# Altium project CAN_Termination.PrjPcb
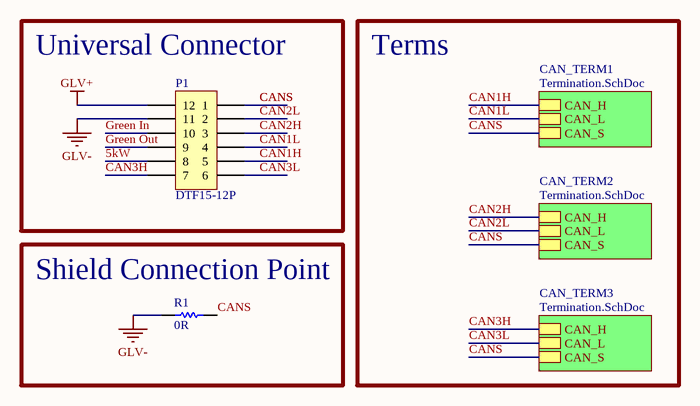
[diagram p0: Top_Level.SchDoc]
2 sheets, 14 parts. Net scope: hierarchical (ports join the sheet entries above them; power ports are global).
Board file: PCB.PcbDoc
Sheets:
  Top_Level.SchDoc
    CAN_TERM1 = Termination.SchDoc
    CAN_TERM2 = Termination.SchDoc
    CAN_TERM3 = Termination.SchDoc

## Sheet Top_Level.SchDoc
size A4; SheetNumber: 1; SheetTotal: 2

### Parts
P1  DTF15-12P  [DTF15-12P]
R1  0R  [0805]

### Blocks framed on the sheet
Universal Connector: P1
Shield Connection Point: R1

### Sub-sheets
CAN_TERM1 = Termination.SchDoc: CAN_H, CAN_L, CAN_S
CAN_TERM2 = Termination.SchDoc: CAN_H, CAN_L, CAN_S
CAN_TERM3 = Termination.SchDoc: CAN_H, CAN_L, CAN_S

### Nets
GLV+: P1.12
GLV-: P1.11 R1.1
5kW: P1.8
CAN1H: P1.5 ; sheet CAN_TERM1/CAN_H
CAN1L: P1.4 ; sheet CAN_TERM1/CAN_L
CAN2H: P1.3 ; sheet CAN_TERM2/CAN_H
CAN2L: P1.2 ; sheet CAN_TERM2/CAN_L
CAN3H: P1.7 ; sheet CAN_TERM3/CAN_H
CAN3L: P1.6 ; sheet CAN_TERM3/CAN_L
CANS: P1.1 R1.2 ; sheet CAN_TERM1/CAN_S, sheet CAN_TERM2/CAN_S, sheet CAN_TERM3/CAN_S
Green In: P1.10
Green Out: P1.9

### Notes on the sheet
- Terms

### Library data of the parts
P1 = DTF15-12P[[/\]]DTF15-12P: Positions: 12; Pitch: 4.44mm; Row Spacing: 9.12 mm; Angle: 0; Flange: No; Contact: Copper Alloy; Part Number: DTF15-12P; Digikey Part Number: 1734-1647-ND; Digikey Link: https://www.digikey.com.au/product-detail/en/te-connectivity-deutsch-connectors/DTF15-12PA/1734-1647-ND/7220164
R1 = RC0805FR070RL: DNP; Manufacturer: YAGEO; Tolerance: 0.01; Rated Voltage: 0.125W; Part Number: RC0805FR070RL; Value: 0R; Material: FR-07; Digikey Part Number: 311-0.0CRCT-ND

## Sheet Termination.SchDoc
size A4; SheetNumber: 2; SheetTotal: 2
Used 3 times, as channels CAN_TERM1, CAN_TERM2, CAN_TERM3. Parts and nets are listed once, with the designators drawn on the sheet.
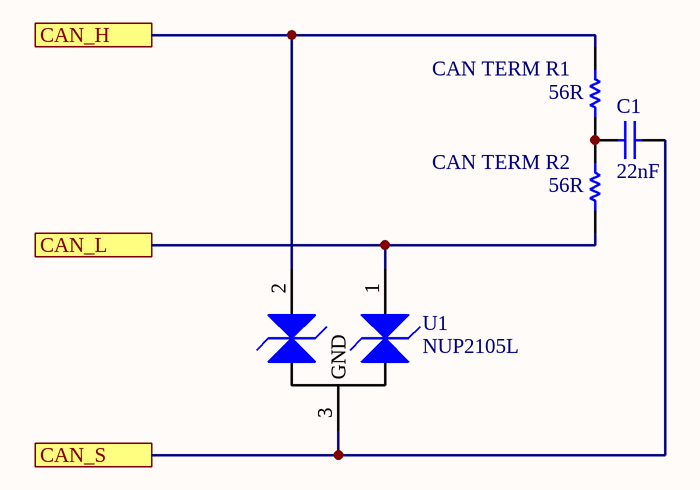
[diagram p1: Termination.SchDoc]

### Parts
C1  22nF  [0805]
CAN_TERM_R1  56R  [0805]
CAN_TERM_R2  56R  [0805]
U1  NUP2105L  [ON SOT-23]

### Ports
CAN_H, CAN_L, CAN_S

### Nets
CAN_H: CAN_TERM_R1.2 U1.2(CAN_L) ; port CAN_H
CAN_L: CAN_TERM_R2.1 U1.1(CAN_H) ; port CAN_L
CAN_S: C1.2 U1.3(GND) ; port CAN_S
NetC1_1: C1.1 CAN_TERM_R1.1 CAN_TERM_R2.2

### Channels
CAN_TERM1: designators C1=C?_CAN_TERM1 CAN TERM R1=CAN_TERM_R?_CAN_TERM1#1 CAN TERM R2=CAN_TERM_R?_CAN_TERM1#2 U1=U?_CAN_TERM1; ports CAN_H=CAN1H CAN_L=CAN1L CAN_S=CANS
CAN_TERM2: designators C1=C?_CAN_TERM2 CAN TERM R1=CAN_TERM_R?_CAN_TERM2#1 CAN TERM R2=CAN_TERM_R?_CAN_TERM2#2 U1=U?_CAN_TERM2; ports CAN_H=CAN2H CAN_L=CAN2L CAN_S=CANS
CAN_TERM3: designators C1=C?_CAN_TERM3 CAN TERM R1=CAN_TERM_R?_CAN_TERM3#1 CAN TERM R2=CAN_TERM_R?_CAN_TERM3#2 U1=U?_CAN_TERM3; ports CAN_H=CAN3H CAN_L=CAN3L CAN_S=CANS

### Library data of the parts
C1 = GCM21B5C1H223JA16L: Manufacturer: muRata; Tolerance: ±5%; Material: C0G, NP0; Rated Voltage: 50V; Part Number: GCM21B5C1H223JA16L; Value: 22nF; Digikey Part Number: 490-5318-1-ND
CAN_TERM_R1 CAN_TERM_R2 = RC0805FR0756RL: Manufacturer: YAGEO; Tolerance: 0.01; Rated Voltage: 0.125W; Part Number: RC0805FR0756RL; Value: 56R; Material: FR-07; Digikey Part Number: 311-56.0CRCT-ND
U1 = NUP2105L: Dual Line CAN Bus Protector; Manufacturer: ON Semiconductor; Part Number: NUP2105L; Digikey Part Number: NUP2105LT1GOSCT-ND; Digikey Link: https://www.digikey.com/product-detail/en/on-semiconductor/NUP2105LT1G/NUP2105LT1GOSCT-ND/1485001

## Nets that join several sheets
CAN1H: Top_Level (P1.5), CAN_TERM1 (CAN_TERM_R?_CAN_TERM1#1.2 U?_CAN_TERM1.2)
CAN1L: Top_Level (P1.4), CAN_TERM1 (CAN_TERM_R?_CAN_TERM1#2.1 U?_CAN_TERM1.1)
CAN2H: Top_Level (P1.3), CAN_TERM2 (CAN_TERM_R?_CAN_TERM2#1.2 U?_CAN_TERM2.2)
CAN2L: Top_Level (P1.2), CAN_TERM2 (CAN_TERM_R?_CAN_TERM2#2.1 U?_CAN_TERM2.1)
CAN3H: Top_Level (P1.7), CAN_TERM3 (CAN_TERM_R?_CAN_TERM3#1.2 U?_CAN_TERM3.2)
CAN3L: Top_Level (P1.6), CAN_TERM3 (CAN_TERM_R?_CAN_TERM3#2.1 U?_CAN_TERM3.1)
CANS: Top_Level (P1.1 R1.2), CAN_TERM1 (C?_CAN_TERM1.2 U?_CAN_TERM1.3), CAN_TERM2 (C?_CAN_TERM2.2 U?_CAN_TERM2.3), CAN_TERM3 (C?_CAN_TERM3.2 U?_CAN_TERM3.3)